# EAGLE design node (EAGLE 6.4)
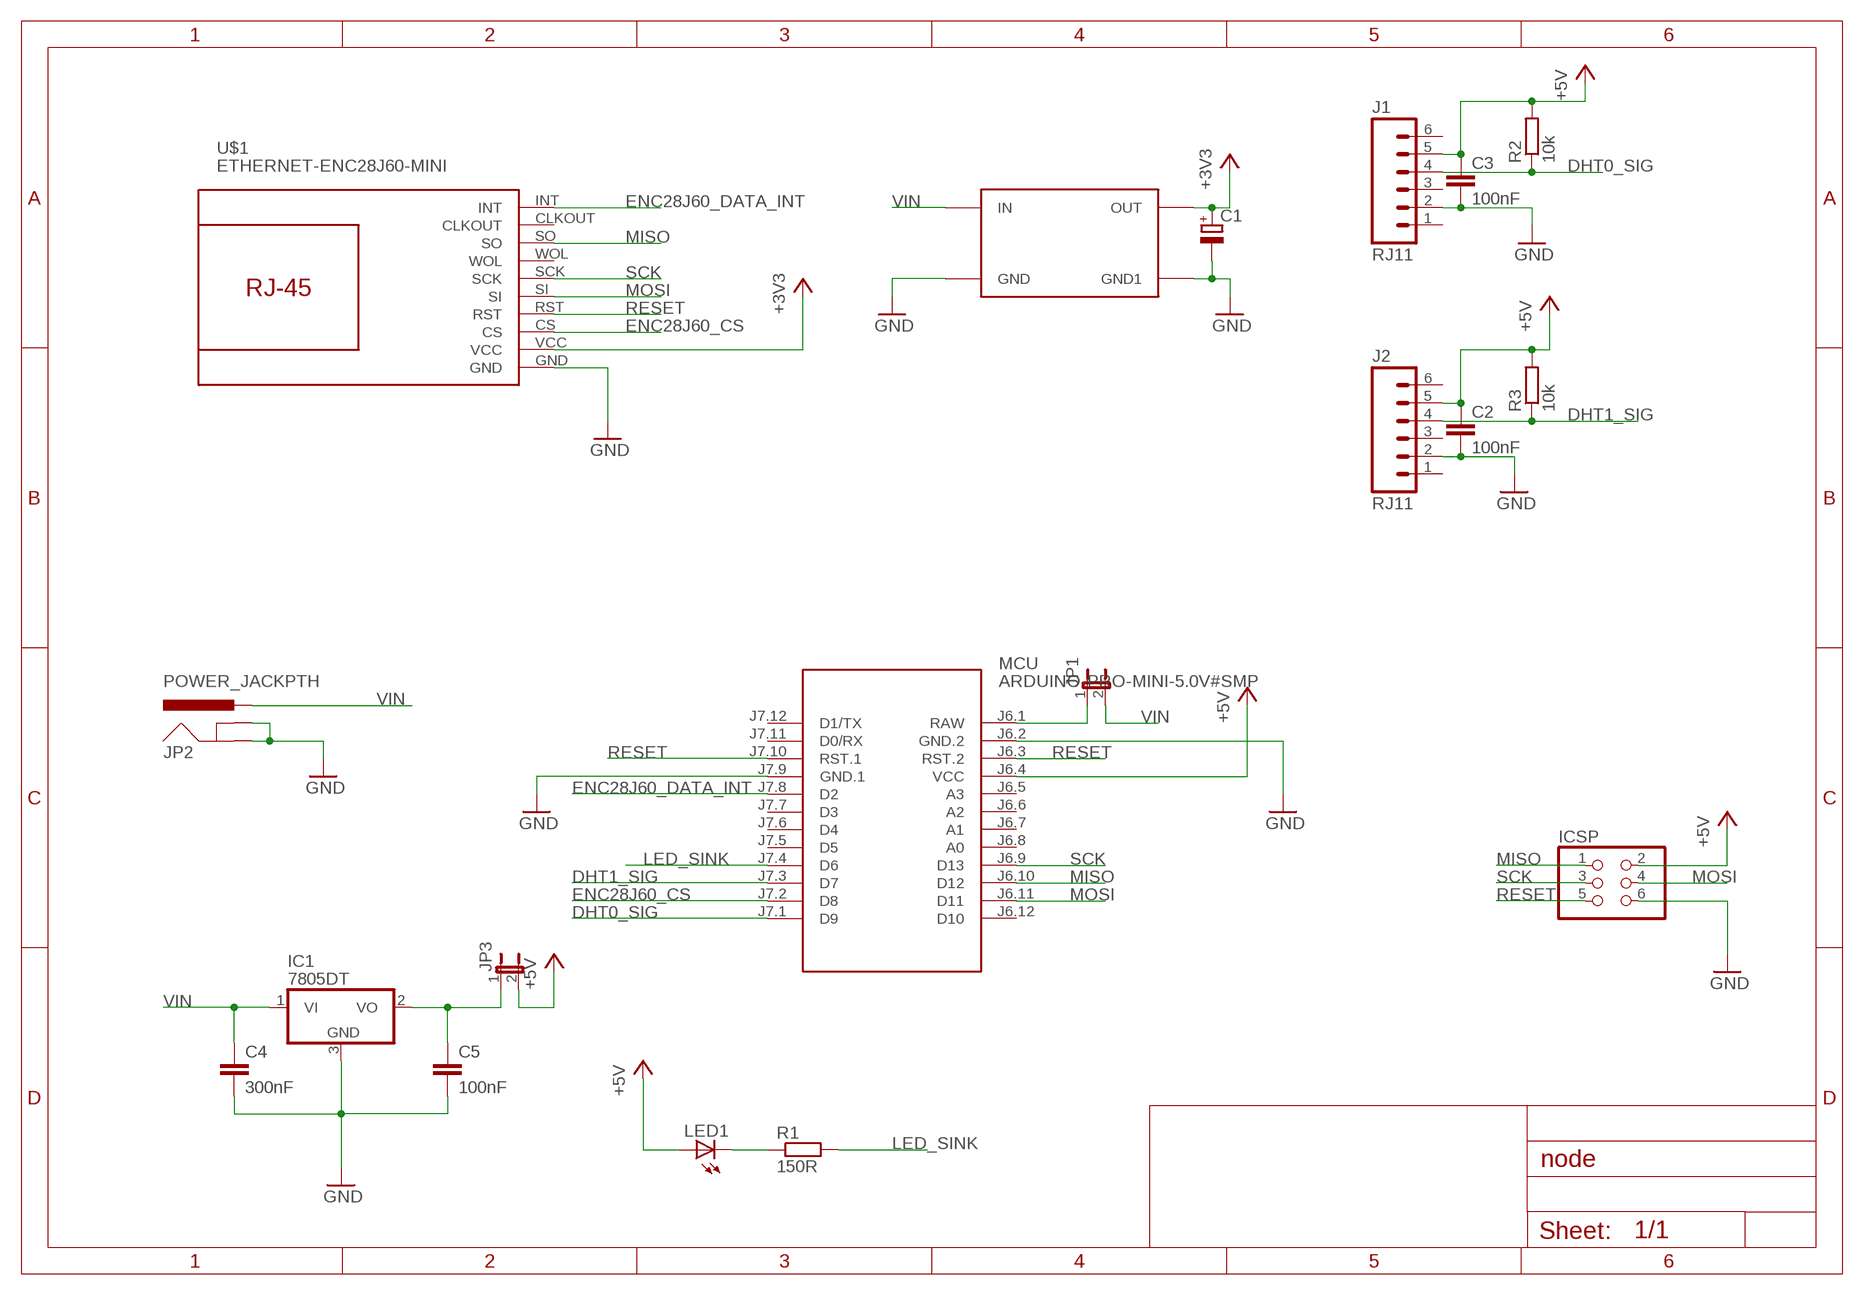
[diagram p0: schematic, sheet 1]

## Parts
C1  CPOL-EUE2.5-6  [E2,5-6]
C2  100nF  C-EUC0805  [C0805]
C3  100nF  C-EUC0805  [C0805]
C4  300nF  C-EUC0805  [C0805]
C5  100nF  C-EUC0805  [C0805]
IC1  7805DT  [TO252]
ICSP  PINHD-2X3  [2X03]
J1  RJ11  RJ11-6PTH  [RJ11-6]
J2  RJ11  RJ11-6PTH  [RJ11-6]
JP1  JP1E  [JP1]
JP2  POWER_JACKPTH  [POWER_JACK_PTH]
JP3  JP1E  [JP1]
LED1  LED3MM  [LED3MM]
MCU  ARDUINO-PRO-MINI-5.0V#SMP  [ARDUINO-PRO-MINI#SMP]
R1  150R  R-EU_R0805  [R0805]
R2  10k  R-EU_R0805  [R0805]
R3  10k  R-EU_R0805  [R0805]
U$1  ETHERNET-ENC28J60-MINI  [ETHERNET-ENC28J60-MINI]
U$2  DC-DC-SMALL  [DC-DC]

## Nets
+3V3: C1.+ U$1.VCC U$2.P$2(OUT)
+5V: C2.1 C3.1 ICSP.2 J1.5 J2.5 JP3.2 LED1.A MCU.J6.4(VCC) R2.2 R3.2
DHT0_SIG: J1.4 MCU.J7.1(D9) R2.1
DHT1_SIG: J2.4 MCU.J7.3(D7) R3.1
ENC28J60_CS: MCU.J7.2(D8) U$1.CS
ENC28J60_DATA_INT: MCU.J7.8(D2) U$1.INT
GND: C1.- C2.2 C3.2 C4.2 C5.2 IC1.3(GND) ICSP.6 J1.2 J2.2 JP2.GND JP2.GNDBREAK MCU.J6.2(GND.2) MCU.J7.9(GND.1) U$1.GND U$2.P$3(GND) U$2.P$4(GND1)
LED_SINK: MCU.J7.4(D6) R1.2
MISO: ICSP.1 MCU.J6.10(D12) U$1.SO
MOSI: ICSP.4 MCU.J6.11(D11) U$1.SI
N$1: LED1.K(C) R1.1
N$2: JP1.1 MCU.J6.1(RAW)
N$3: C5.1 IC1.2(VO) JP3.1
RESET: ICSP.5 MCU.J6.3(RST.2) MCU.J7.10(RST.1) U$1.RST
SCK: ICSP.3 MCU.J6.9(D13) U$1.SCK
VIN: C4.1 IC1.1(VI) JP1.2 JP2.PWR U$2.P$1(IN)
Unconnected: J1.1 J1.3 J1.6 J2.1 J2.3 J2.6 MCU.J6.5(A3) MCU.J6.6(A2) MCU.J6.7(A1) MCU.J6.8(A0) MCU.J6.12(D10) MCU.J7.5(D5) MCU.J7.6(D4) MCU.J7.7(D3) MCU.J7.11(D0/RX) MCU.J7.12(D1/TX) U$1.CLKOUT U$1.WOL

## Library data of the parts
C1 = rcl:CPOL-EU: POLARIZED CAPACITOR, European symbol
C2-C5 = rcl:C-EU: CAPACITOR, European symbol
IC1 = linear:78*: Positive VOLTAGE REGULATOR Source: http://cache.national.com/ds/LM/LM78L05.pdf http://www.fairchildsemi.com/ds/LM/LM7805.pdf
ICSP = pinhead:PINHD-2X3: PIN HEADER
J1 J2 = SparkFun-Connectors:RJ11-6: RJ11 Jack Simple 6 pin RJ11 jack. Commonly found on CAT3 devices and Microchip programmers. SKU: PRT-00132; PROD_ID: CONN-08590
JP1 JP3 = jumper:JP1E: JUMPER
JP2 = SparkFun-Connectors:POWER_JACK: Power Jack This is the standard 5.5mm barrel jack for power. The PTH is the most common, proven, reliable, footprint. The Slot footprint only works if the mill layer is transmitted to the PCB fab house so be warned. Mating wall wart : TOL-00298 (and others); PROD_ID: CONN-08197
LED1 = adafruit:LED: LED OSRAM: - CHIPLED LG R971, LG N971, LY N971, LG Q971, LY Q971, LO R971, LY R971 LH N974, LH R974 LS Q976, LO Q976, LY Q976 LO Q996 - Hyper CHIPLED LW Q18S LB Q993, LB Q99A, LB R99A - SideLED LS A670, LO A670, LY A670, LG A670, LP A670 LB A673, LV A673, LT A673, LW A673 LH A674 LY A675 LS A676, LA A676, LO A676, LY A676, LW A676 LS A679, LY A679, LG A679 - Hyper Micro SIDELED® LS Y876, LA Y876, LO Y876, LY Y876 LT Y87S - SmartLED LW L88C, LW L88S LB L89C, LB L89S, LG L890 LS L89K, LO L89K, LY L89K LS L896, LA L896, LO L896, LY L896 - TOPLED LS T670, LO T670, LY T670, LG T670, LP T670 LSG T670, LSP T670, LSY T670, LOP T670, LYG T670 LG T671, LOG T671, LSG T671 LB T673, LV T673, LT T673, LW T673 LH T674 LS T676, LA T676, LO T676, LY T676, LB T676, LH T676, LSB T676, LW T676 LB T67C, LV T67C, LT T67C, LS T67K, LO T67K, LY T67K, LW E67C LS E67B, LA E67B, LO E67B, LY E67B, LB E67C, LV E67C, LT E67C LW T67C LS T679, LY T679, LG T679 LS T770, LO T770, LY T770, LG T770, LP T770 LB T773, LV T773, LT T773, LW T773 LH T774 LS E675, LA E675, LY E675, LS T675 LS T776, LA T776, LO T776, LY T776, LB T776 LHGB T686 LT T68C, LB T68C - Hyper Mini TOPLED® LB M676 - Mini TOPLED Santana® LG M470 LS M47K, LO M47K, LY M47K Source: http://www.osram.convergy.de/
MCU = diy-modules:ARDUINO-PRO-MINI-*#SMP: Arduino Pro Mini with 2 connectors only
R1-R3 = rcl:R-EU_: RESISTOR, European symbol
U$1 = diy-modules:ETHERNET-ENC28J60-MINI
U$2 = OK1CDJ-E6:DC-DC-SMALL

## Board
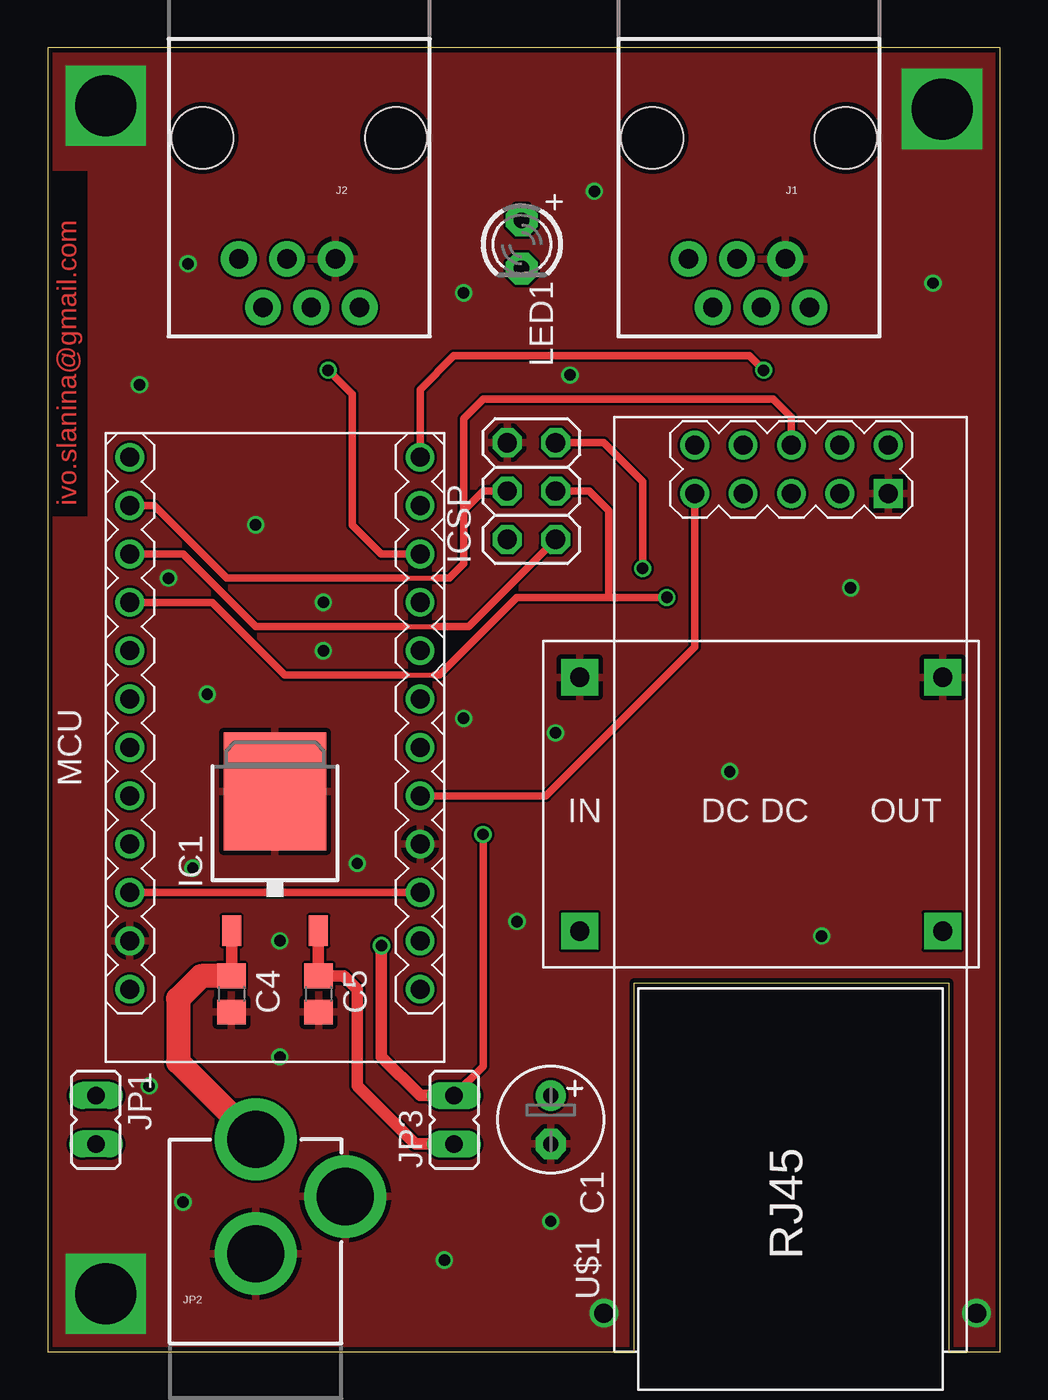
[diagram p1: board, top side]
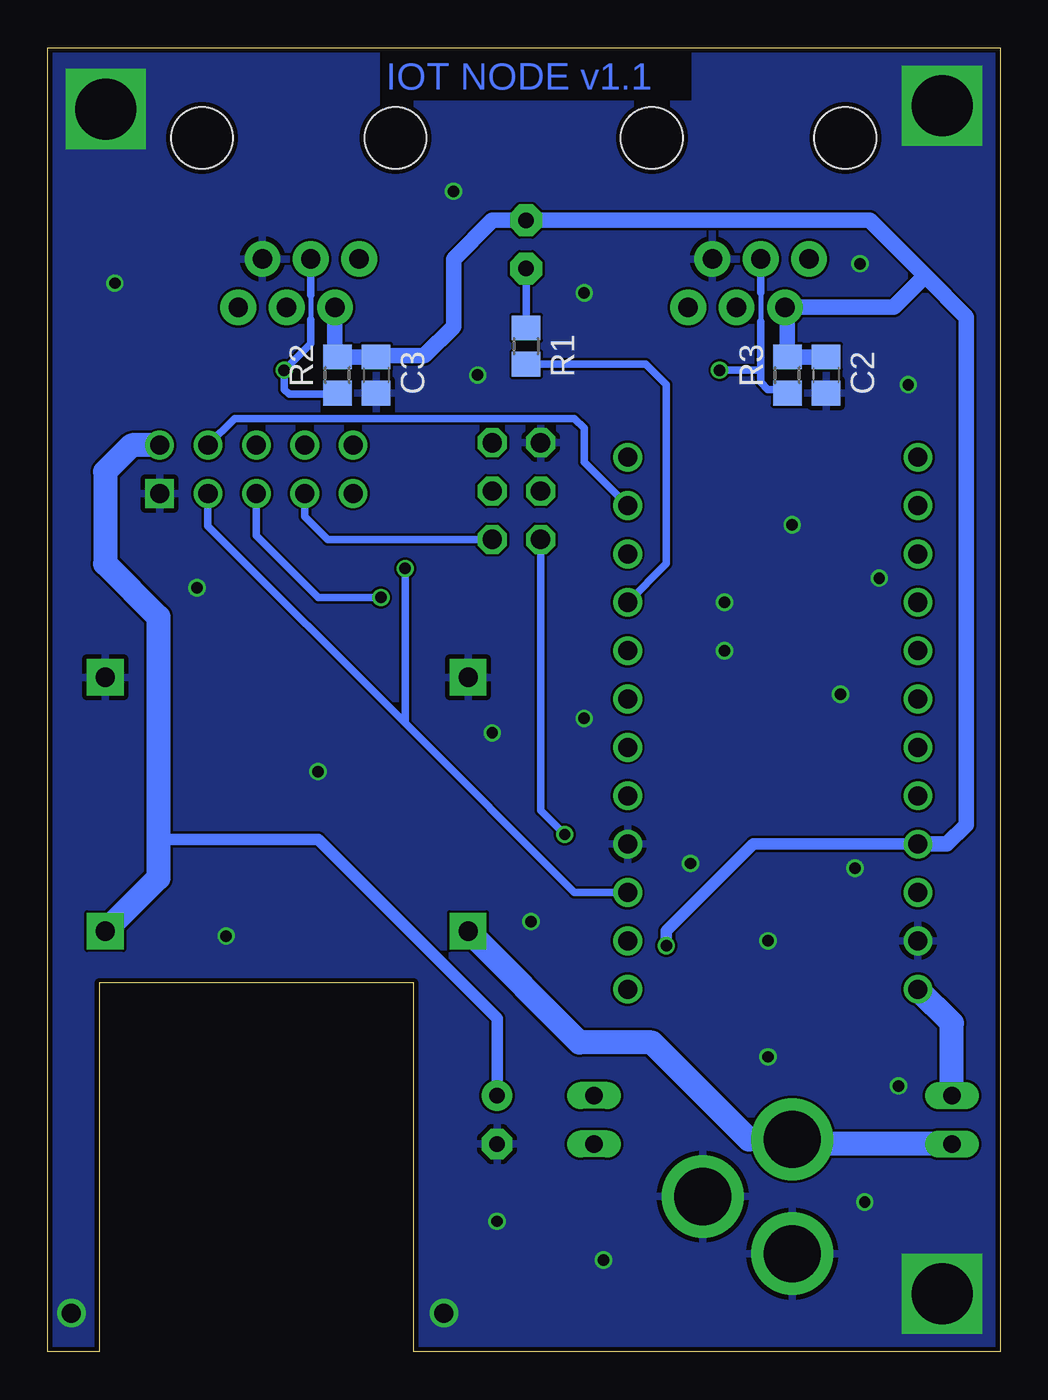
[diagram p2: board, bottom side, seen from below]

Size 50.01 x 68.5 mm. Coordinates in mm from the lower left corner, seen from the top.
Outline: 0,0 30.8,0 30.8,19.37 47.31,19.37 47.31,0 50.01,0 50.01,68.5 0,68.5 0,0
Copper layers (1*16): Top 0.035mm / dielectric 1.5mm / Bottom 0.035mm
Design rules "dirt_cheap_dirty_boards.v1": minimum track width 5mil, minimum drill 12mil, track to track 5mil, track to pad 5mil, pad to pad 5mil, via to via 5mil, smd to smd 0mil, copper to edge 10mil, drill to drill 10mil, minimum pad ring 10mil, minimum via ring 6mil, stop-mask expansion 2mil, vias tented up to drill 25mil, thermal gap 10mil

### Footprints (pad centres in the part's own frame; a part is rotated, then mirrored left to right if it is on the bottom)
E2,5-6 = drill 0.813 pad 1.6: + -1.27,0 | drill 0.813 pad 1.6 octagon: - 1.27,0
C0805 = smd 1.3 x 1.5: 1 -0.95,0; 2 0.95,0
TO252 = smd 1 x 1.6: 1 -2.28,-4.8; 2 2.28,-4.8 | smd 5.4 x 6.2: 3 0,2.5
2X03 = drill 1.016 octagon: 1 -2.54,-1.27; 2 -2.54,1.27; 3 0,-1.27; 4 0,1.27; 5 2.54,-1.27; 6 2.54,1.27
RJ11-6 = drill 1.016 pad 1.88: 1 -3.175,8.89; 2 -1.905,6.35; 3 -0.635,8.89; 4 0.635,6.35; 5 1.905,8.89; 6 3.175,6.35 | hole 3.251: -5.08,0; 5.08,0
JP1 = drill 0.914 long: 1 0,-1.27; 2 0,1.27
POWER_JACK_PTH = drill 2.997 pad 4.318: GND 0,7.7; GNDBREAK 4.7,10.7; PWR 0,13.7
LED3MM = drill 0.813 pad 1.676 octagon: A -1.27,0; K 1.27,0
ARDUINO-PRO-MINI#SMP = drill 1: J6.1 -12.7,7.62; J6.2 -10.16,7.62; J6.3 -7.62,7.62; J6.4 -5.08,7.62; J6.5 -2.54,7.62; J6.6 0,7.62; J6.7 2.54,7.62; J6.8 5.08,7.62; J6.9 7.62,7.62; J6.10 10.16,7.62; J6.11 12.7,7.62; J6.12 15.24,7.62; J7.1 15.24,-7.62; J7.2 12.7,-7.62; J7.3 10.16,-7.62; J7.4 7.62,-7.62; J7.5 5.08,-7.62; J7.6 2.54,-7.62; J7.7 0,-7.62; J7.8 -2.54,-7.62; J7.9 -5.08,-7.62; J7.10 -7.62,-7.62; J7.11 -10.16,-7.62; J7.12 -12.7,-7.62
R0805 = smd 1.3 x 1.5: 1 -0.95,0; 2 0.95,0
ETHERNET-ENC28J60-MINI = drill 1: CLKOUT 47.625,14.287; CS 47.625,6.668; INT 45.085,14.287; RST 45.085,6.668; SCK 45.085,9.207; SI 47.625,9.207; SO 45.085,11.748; VCC 47.625,4.128; WOL 47.625,11.748 | drill 1 square: GND 45.085,4.128
DC-DC = drill 1 pad 1.93 square: P$1 1.27,1.27; P$2 20.32,1.27; P$3 1.27,14.605; P$4 20.32,14.605

### Placement (x,y rotation side)
C1  26.42,12.19 270 top
C2  9.14,51.31 270 bottom
C3  32.77,51.31 270 bottom
C4  9.65,18.8 270 top
C5  14.22,18.8 270 top
IC1  11.94,26.92 0 top
ICSP  25.4,45.21 90 top
J1  36.83,63.75 180 top
J2  13.21,63.75 180 top
JP1  2.54,12.19 180 top
JP2  10.92,-2.54 0 top
JP3  21.34,12.19 0 top
LED1  24.89,58.17 270 top
MCU  11.94,31.75 90 top
R1  24.89,52.83 270 bottom
R2  34.8,51.31 90 bottom
R3  11.18,51.31 90 bottom
U$1  48.26,0 90 top
U$2  26.67,20.83 0 top

### Tracks (layer width: path | path; a pad name or v marks a point on that pad's centre or on a via)
+3V3
  Bottom 0.61: C1.+ 26.42,17.53 35.81,26.92 43.94,26.92 44.2,26.67
  Bottom 1.27: U$1.VCC 45.59,47.62 46.99,46.23 46.99,41.4 44.2,38.61 44.2,26.67 44.2,24.89 U$2.P$2
+5V  (via drill 0.6)
  Top 0.406: v22.86,27.18 22.86,14.99 JP3.2
  Top 0.61: JP3.2 19.56,13.46 17.53,15.49 v17.53,21.34
  Bottom 0.406: ICSP.2 24.13,28.45 v22.86,27.18
  Bottom 0.61: MCU.J6.4 12.95,26.67 17.53,22.1 v17.53,21.34
  Bottom 0.813: MCU.J6.4 2.79,26.67 1.78,27.69 1.78,54.36 3.94,56.52 | 3.94,56.52 6.86,59.44 LED1.A 26.67,59.44 28.7,57.4 28.7,53.85 30.23,52.32 32.7,52.32 C3.1 R2.2 34.92,52.38 J1.5 | 3.94,56.52 5.59,54.86 J2.5 11.18,54.74 R3.2 C2.1
DHT0_SIG  (via drill 0.6)
  Top 0.406: MCU.J7.1 19.56,50.55 21.34,52.32 36.83,52.32 v37.59,51.56
  Bottom 0.254: 36.2,55.5 36.2,54.23
  Bottom 0.406: R2.1 34.86,50.29 37.34,50.29 37.59,50.55 v37.59,51.56 36.2,52.96 36.2,54.23 | J1.4 36.2,55.5
DHT1_SIG  (via drill 0.6)
  Top 0.406: MCU.J7.3 17.53,41.91 16,43.43 16,50.29 v14.73,51.56
  Bottom 0.254: 12.57,55.63 12.57,54.1
  Bottom 0.406: J2.4 12.57,55.63 | 12.57,54.1 12.57,51.56 | 12.57,51.56 12.57,50.93 12.19,50.55 11.36,50.55 R3.1 | v14.73,51.56 12.57,51.56
ENC28J60_CS
  Bottom 0.406: MCU.J7.2 21.84,46.74 21.84,48.51 22.35,49.02 40.2,49.02 U$1.CS
ENC28J60_DATA_INT
  Top 0.406: U$1.INT 33.97,37.02 26.16,29.21 MCU.J7.8
GND  (via drill 0.6, 1, 3.2)
  other vias: 3.05,3.05 29.21,2.03 48.77,2.03 3.05,65.46 46.96,65.28 4.83,50.8 21.84,55.63 28.7,60.96 42.16,40.13 35.81,30.48 40.64,21.84 7.62,25.4 12.19,21.59 7.11,7.87 20.83,4.83 26.42,6.86 24.64,22.61 21.84,33.27 26.67,32.51 10.92,43.43 14.48,39.37 14.48,36.83 8.38,34.54 16.26,25.65 46.48,56.13 7.37,57.15 6.35,40.64 5.33,13.97 12.19,15.49 27.43,51.31
  pour Bottom: -0.25,68.83 -0.25,-0.25 50.29,-0.25 50.29,68.83 32.77,68.83 32.77,65.53 16,65.53 16,68.83
  pour Top: 50.29,68.83 -0.25,68.83 -0.25,62.23 2.29,62.23 2.29,43.69 -0.25,43.69 -0.25,-0.25 50.29,-0.25
LED_SINK
  Bottom 0.406: R1.2 18.61,51.88 17.53,50.8 17.53,41.4 MCU.J7.4
MISO
  Top 0.254: 18.8,38.1 20.32,38.1
  Top 0.406: MCU.J6.10 7.11,41.91 10.92,38.1 18.8,38.1 | 20.32,38.1 22.1,38.1 ICSP.1
  Bottom 0.406: U$1.SO 36.51,43.88 35.31,42.67 ICSP.1
MOSI
  Top 0.254: 18.8,40.64 20.32,40.64
  Top 0.406: MCU.J6.11 5.59,44.45 9.4,40.64 18.8,40.64 | 20.32,40.64 21.08,40.64 21.84,41.4 21.84,43.18 21.84,44.2 | 21.84,44.2 22.86,45.21 ICSP.4 | U$1.SI 39.05,49.09 38.1,50.04 22.86,50.04 21.84,49.02 21.84,44.2
N$1
  Bottom 0.406: LED1.K R1.1
N$2
  Bottom 1.27: JP1.1 2.54,17.27 MCU.J6.1
N$3
  Top 0.61: IC1.2 C5.1 15.56,19.75 16.26,19.05 16.26,13.97 19.3,10.92 JP3.1
RESET  (via drill 0.6)
  Top 0.406: MCU.J6.3 MCU.J7.10 | v31.24,41.15 31.24,45.72 29.21,47.75 ICSP.5
  Bottom 0.406: MCU.J7.10 22.35,24.13 31.24,33.02 | 31.24,33.02 v31.24,41.15 | U$1.RST 41.59,43.37 31.24,33.02
SCK  (via drill 0.6)
  Top 0.254: 18.8,35.56 20.32,35.56
  Top 0.406: MCU.J6.9 8.64,39.37 12.45,35.56 18.8,35.56 | 20.32,35.56 20.57,35.56 24.64,39.62 29.46,39.62 | 29.46,39.62 v32.51,39.62 | ICSP.3 28.45,45.21 29.46,44.2 29.46,39.62
  Bottom 0.406: v32.51,39.62 35.81,39.62 39.05,42.86 U$1.SCK
VIN
  Top 0.61: IC1.1 C4.1
  Top 1.27: C4.1 8.06,19.75 6.86,18.54 6.86,15.22 JP2.PWR
  Bottom 1.27: JP1.2 10.68,10.92 JP2.PWR 13.19,11.16 18.29,16.26 22.1,16.26 U$2.P$1

### Text on the board
Top: ivo.slanina@gmail.com
Bottom: IOT NODE v1.1